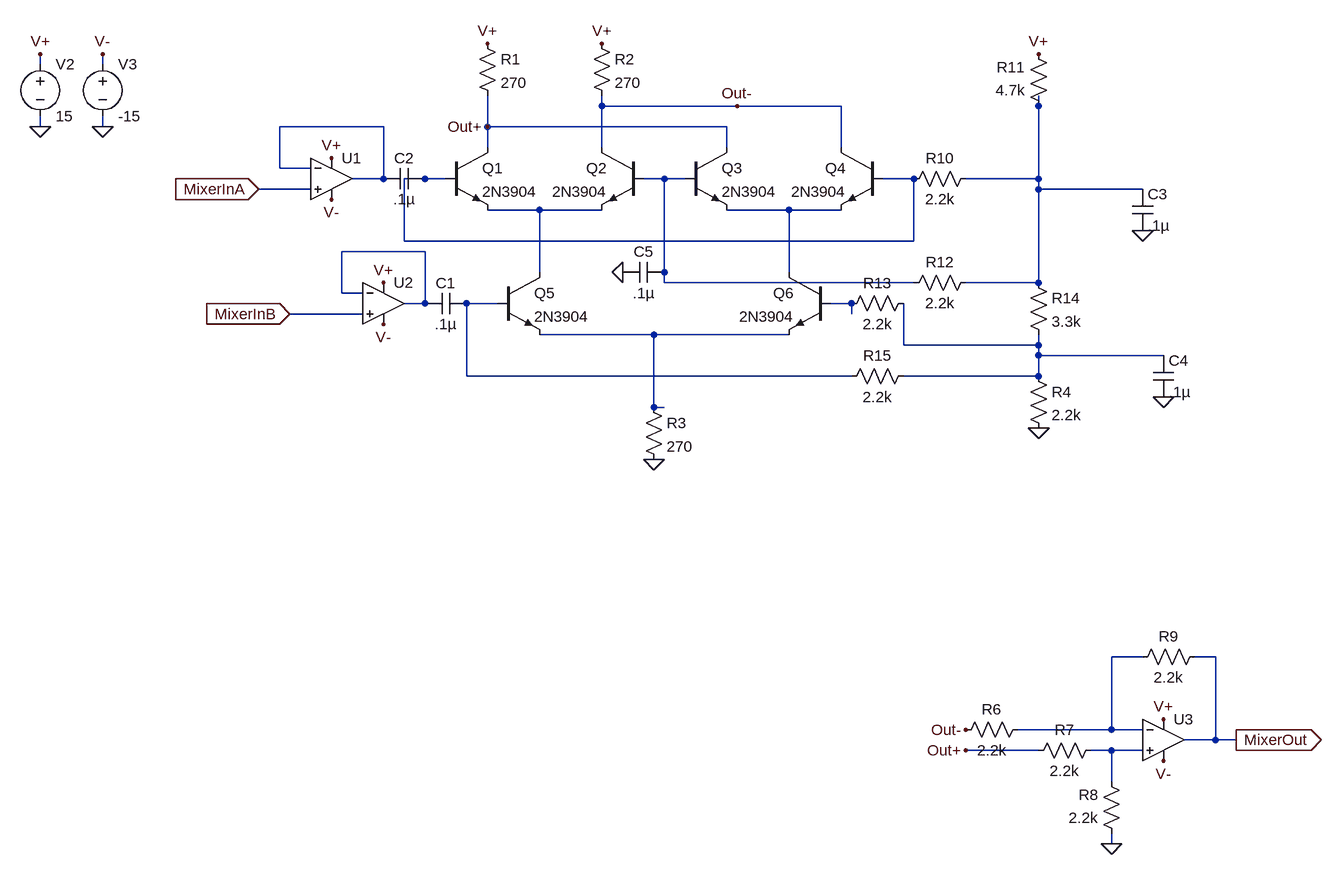
[diagram p0: schematic Mixer.asc]
Mixer.asc, the LTspice schematic file:
Version 4
SHEET 1 2196 1092
WIRE -240 -128 -240 -144
WIRE -144 -128 -144 -144
WIRE 624 -64 624 -80
WIRE 832 -64 624 -64
WIRE 992 -64 832 -64
WIRE 1296 -64 1296 -80
WIRE -240 -32 -240 -48
WIRE -144 -32 -144 -48
WIRE 288 -32 128 -32
WIRE 448 -32 448 -80
WIRE 816 -32 448 -32
WIRE 448 0 448 -32
WIRE 624 0 624 -64
WIRE 816 0 816 -32
WIRE 992 0 992 -64
WIRE 128 32 128 -32
WIRE 176 32 128 32
WIRE 288 48 288 -32
WIRE 288 48 240 48
WIRE 352 48 320 48
WIRE 384 48 352 48
WIRE 720 48 688 48
WIRE 752 48 720 48
WIRE 1104 48 1056 48
WIRE 1296 48 1296 -64
WIRE 1296 48 1184 48
WIRE 176 64 96 64
WIRE 1296 64 1296 48
WIRE 1456 64 1296 64
WIRE 528 96 448 96
WIRE 624 96 528 96
WIRE 912 96 816 96
WIRE 992 96 912 96
WIRE 320 144 320 48
WIRE 1104 144 1104 48
WIRE 1104 144 320 144
WIRE 352 160 224 160
WIRE 528 192 528 96
WIRE 720 192 720 48
WIRE 912 192 912 96
WIRE 720 208 720 192
WIRE 1104 208 720 208
WIRE 1296 208 1296 64
WIRE 1296 208 1184 208
WIRE 224 224 224 160
WIRE 256 224 224 224
WIRE 352 240 352 160
WIRE 352 240 320 240
WIRE 464 240 416 240
WIRE 1008 240 976 240
WIRE 256 256 144 256
WIRE 1008 256 1008 240
WIRE 704 288 528 288
WIRE 912 288 704 288
WIRE 1088 304 1088 240
WIRE 1296 304 1296 288
WIRE 1296 304 1088 304
WIRE 1296 320 1296 304
WIRE 1488 320 1296 320
WIRE 416 352 416 240
WIRE 1008 352 416 352
WIRE 1296 352 1296 320
WIRE 1296 352 1088 352
WIRE 704 400 704 288
WIRE 720 400 704 400
WIRE 1456 784 1408 784
WIRE 1568 784 1536 784
WIRE 1408 896 1408 784
WIRE 1408 896 1264 896
WIRE 1456 896 1408 896
WIRE 1568 912 1568 784
WIRE 1568 912 1520 912
WIRE 1600 912 1568 912
WIRE 1296 928 1184 928
WIRE 1408 928 1376 928
WIRE 1456 928 1408 928
WIRE 1408 976 1408 928
WIRE 1408 1072 1408 1056
FLAG -240 -32 0
FLAG -144 -32 0
FLAG 208 16 V+
FLAG 208 80 V-
FLAG 288 272 V-
FLAG 288 208 V+
FLAG 448 -160 V+
FLAG 624 -160 V+
FLAG 1488 944 V-
FLAG 1488 880 V+
FLAG 1408 1072 0
FLAG 448 -32 Out+
FLAG 1184 928 Out+
FLAG 832 -64 Out-
FLAG 1184 896 Out-
FLAG 704 480 0
FLAG 1296 432 0
FLAG 1296 -144 V+
FLAG 1488 384 0
FLAG 1456 128 0
FLAG 656 192 0
FLAG 1600 912 MixerOut
IOPIN 1600 912 Out
FLAG 96 64 MixerInA
IOPIN 96 64 In
FLAG 144 256 MixerInB
IOPIN 144 256 In
FLAG -240 -144 V+
FLAG -144 -144 V-
SYMBOL voltage -240 -144 R0
WINDOW 123 0 0 Left 0
WINDOW 39 0 0 Left 0
SYMATTR InstName V2
SYMATTR Value 15
SYMBOL voltage -144 -144 R0
WINDOW 123 0 0 Left 0
WINDOW 39 0 0 Left 0
SYMATTR InstName V3
SYMATTR Value -15
SYMBOL Opamps\\UniversalOpamp2 208 48 R0
SYMATTR InstName U1
SYMBOL res 432 -176 R0
SYMATTR InstName R1
SYMATTR Value 270
SYMBOL npn 384 0 R0
SYMATTR InstName Q1
SYMATTR Value 2N3904
SYMBOL npn 688 0 M0
SYMATTR InstName Q2
SYMATTR Value 2N3904
SYMBOL npn 752 0 R0
SYMATTR InstName Q3
SYMATTR Value 2N3904
SYMBOL npn 1056 0 M0
SYMATTR InstName Q4
SYMATTR Value 2N3904
SYMBOL res 608 -176 R0
SYMATTR InstName R2
SYMATTR Value 270
SYMBOL npn 464 192 R0
SYMATTR InstName Q5
SYMATTR Value 2N3904
SYMBOL npn 976 192 M0
SYMATTR InstName Q6
SYMATTR Value 2N3904
SYMBOL Opamps\\UniversalOpamp2 288 240 R0
SYMATTR InstName U2
SYMBOL Opamps\\UniversalOpamp2 1488 912 R0
SYMATTR InstName U3
SYMBOL res 1280 880 R90
WINDOW 0 0 56 VBottom 2
WINDOW 3 32 56 VTop 2
SYMATTR InstName R6
SYMATTR Value 2.2k
SYMBOL res 1392 912 R90
WINDOW 0 0 56 VBottom 2
WINDOW 3 32 56 VTop 2
SYMATTR InstName R7
SYMATTR Value 2.2k
SYMBOL res 1424 1072 R180
WINDOW 0 36 76 Left 2
WINDOW 3 36 40 Left 2
SYMATTR InstName R8
SYMATTR Value 2.2k
SYMBOL res 1440 800 R270
WINDOW 0 32 56 VTop 2
WINDOW 3 0 56 VBottom 2
SYMATTR InstName R9
SYMATTR Value 2.2k
SYMBOL res 1200 32 R90
WINDOW 0 0 56 VBottom 2
WINDOW 3 32 56 VTop 2
SYMATTR InstName R10
SYMATTR Value 2.2k
SYMBOL res 1312 -48 R180
WINDOW 0 36 76 Left 2
WINDOW 3 36 40 Left 2
SYMATTR InstName R11
SYMATTR Value 4.7k
SYMBOL res 1088 224 R270
WINDOW 0 32 56 VTop 2
WINDOW 3 0 56 VBottom 2
SYMATTR InstName R12
SYMATTR Value 2.2k
SYMBOL res 992 256 R270
WINDOW 0 32 56 VTop 2
WINDOW 3 0 56 VBottom 2
SYMATTR InstName R13
SYMATTR Value 2.2k
SYMBOL res 1280 192 R0
SYMATTR InstName R14
SYMATTR Value 3.3k
SYMBOL res 1104 336 R90
WINDOW 0 0 56 VBottom 2
WINDOW 3 32 56 VTop 2
SYMATTR InstName R15
SYMATTR Value 2.2k
SYMBOL res 688 384 R0
SYMATTR InstName R3
SYMATTR Value 270
SYMBOL res 1280 336 R0
SYMATTR InstName R4
SYMATTR Value 2.2k
SYMBOL cap 416 224 R90
WINDOW 0 0 32 VBottom 2
WINDOW 3 32 32 VTop 2
SYMATTR InstName C1
SYMATTR Value .1µ
SYMBOL cap 352 32 R90
WINDOW 0 0 32 VBottom 2
WINDOW 3 32 32 VTop 2
SYMATTR InstName C2
SYMATTR Value .1µ
SYMBOL cap 1440 64 R0
SYMATTR InstName C3
SYMATTR Value .1µ
SYMBOL cap 1472 320 R0
SYMATTR InstName C4
SYMATTR Value .1µ
SYMBOL cap 720 176 R90
WINDOW 0 0 32 VBottom 2
WINDOW 3 32 32 VTop 2
SYMATTR InstName C5
SYMATTR Value .1µ

The netlist it stands for:
* Mixer.asc
V2 V+ 0 15
V3 V- 0 -15
XU1 MixerInA N002 V+ V- N002 level.2 Avol=1Meg GBW=10Meg Slew=10Meg ilimit=25m rail=0 Vos=0 phimargin=45 en=0 enk=0 in=0 ink=0 Rin=500Meg  ; pins IN+ IN- V+ V- OUT
R1 V+ Out+ 270
Q1 Out+ N003 N005 0 2N3904
Q2 Out- N004 N005 0 2N3904
Q3 Out+ N004 N006 0 2N3904
Q4 Out- N003 N006 0 2N3904
R2 V+ Out- 270
Q5 N005 N008 N010 0 2N3904
Q6 N006 N009 N010 0 2N3904
XU2 MixerInB N007 V+ V- N007 level.2 Avol=1Meg GBW=10Meg Slew=10Meg ilimit=25m rail=0 Vos=0 phimargin=45 en=0 enk=0 in=0 ink=0 Rin=500Meg  ; pins IN+ IN- V+ V- OUT
XU3 N013 N012 V+ V- MixerOut level.2 Avol=1Meg GBW=10Meg Slew=10Meg ilimit=25m rail=0 Vos=0 phimargin=45 en=0 enk=0 in=0 ink=0 Rin=500Meg  ; pins IN+ IN- V+ V- OUT
R6 N012 Out- 2.2k
R7 N013 Out+ 2.2k
R8 0 N013 2.2k
R9 N012 MixerOut 2.2k
R10 N001 N003 2.2k
R11 N001 V+ 4.7k
R12 N004 N001 2.2k
R13 N009 N011 2.2k
R14 N001 N011 3.3k
R15 N011 N008 2.2k
R3 N010 0 270
R4 N011 0 2.2k
C1 N008 N007 .1µ
C2 N003 N002 .1µ
C3 N001 0 .1µ
C4 N011 0 .1µ
C5 N004 0 .1µ
.model NPN NPN
.model PNP PNP
.lib standard.bjt
.lib UniversalOpamps2.sub
.backanno
.end